# Altium project QCopterRC.PrjPCB
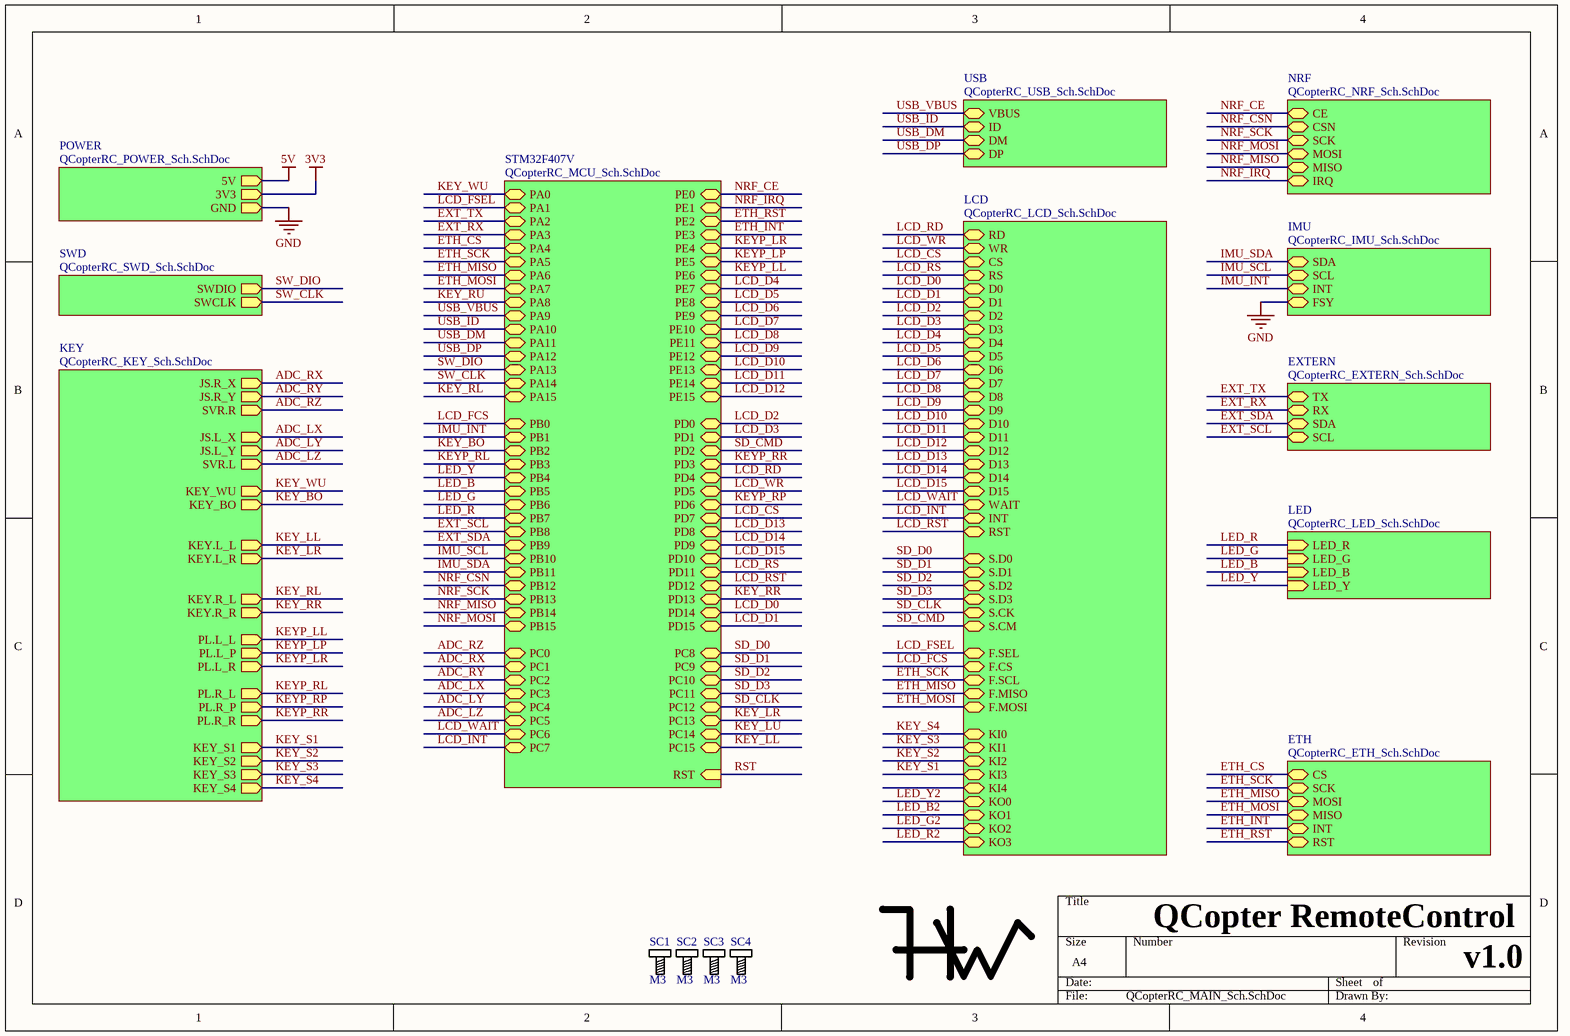
[diagram p0: QCopterRC_MAIN_Sch.SchDoc]
12 sheets, 127 parts. Net scope: hierarchical (ports join the sheet entries above them; power ports are global).
Board file: QCopterRC__Pcb.PcbDoc
Sheets:
  QCopterRC_MAIN_Sch.SchDoc
    POWER = QCopterRC_POWER_Sch.SchDoc
    SWD = QCopterRC_SWD_Sch.SchDoc
    LED = QCopterRC_LED_Sch.SchDoc
    STM32F407V = QCopterRC_MCU_Sch.SchDoc
    LCD = QCopterRC_LCD_Sch.SchDoc
    USB = QCopterRC_USB_Sch.SchDoc
    NRF = QCopterRC_NRF_Sch.SchDoc
    IMU = QCopterRC_IMU_Sch.SchDoc
    EXTERN = QCopterRC_EXTERN_Sch.SchDoc
    ETH = QCopterRC_ETH_Sch.SchDoc
    KEY = QCopterRC_KEY_Sch.SchDoc

## Sheet QCopterRC_MAIN_Sch.SchDoc
size A4

### Parts
HW1  HW  [Logo_HW]  (value not drawn)
SC1  M3  [SCRREW_M3]
SC2  M3  [SCRREW_M3]
SC3  M3  [SCRREW_M3]
SC4  M3  [SCRREW_M3]

### Sub-sheets
ETH = QCopterRC_ETH_Sch.SchDoc: MISO, MOSI, SCK, CS, INT, RST
EXTERN = QCopterRC_EXTERN_Sch.SchDoc: SDA, SCL, TX, RX
IMU = QCopterRC_IMU_Sch.SchDoc: SCL, SDA, FSY, INT
KEY = QCopterRC_KEY_Sch.SchDoc: KEY_WU (out), KEY_BO (out), JS.R_Y (out), JS.R_X (out), JS.L_X (out), JS.L_Y (out), SVR.R (out), SVR.L (out), KEY.L_L (out), KEY.L_R (out), KEY.R_L (out), KEY.R_R (out), PL.L_L (out), PL.L_P (out), PL.L_R (out), PL.R_R (out), PL.R_P (out), PL.R_L (out), KEY_S1 (out), KEY_S2 (out), KEY_S3 (out), KEY_S4 (out)
LCD = QCopterRC_LCD_Sch.SchDoc: RS, CS, WR, RD, RST, D0, D1, D2, D3, D4, D5, D6, D7, D8, D9, D10, D11, D12, D13, D14, D15, WAIT, INT, S.D0, S.CK, S.CM, S.D1, S.D2, S.D3, F.CS, F.SCL, F.MISO, F.MOSI, F.SEL, KI0, KI1, KI2, KI3, KI4, KO0, KO1, KO2, KO3
LED = QCopterRC_LED_Sch.SchDoc: LED_R (in), LED_G (in), LED_B (in), LED_Y (in)
NRF = QCopterRC_NRF_Sch.SchDoc: MISO, MOSI, SCK, CSN, CE, IRQ
POWER = QCopterRC_POWER_Sch.SchDoc: 3V3 (out), 5V (out), GND (out)
STM32F407V = QCopterRC_MCU_Sch.SchDoc: PA0, PA1, PA2, PA3, PA4, PA5, PA6, PA7, PA8, PA9, PA10, PA11, PA12, PA13, PA14, PA15, PB0, PB1, PB2, PB3, PB4, PB5, PB6, PB7, PB8, PB9, PB10, PB11, PB12, PB13, PB14, PB15, PC0, PC1, PC2, PC3, PC4, PC5, PC6, PC7, PC8, PC9, PC10, PC11, PC12, PC13, PC14, PC15, PD0, PD1, PD2, PD3, PD4, PD5, PD6, PD7, PD8, PD9, PD10, PD11, PD12, PD13, PD14, PD15, RST (in), PE0, PE1, PE2, PE3, PE4, PE5, PE6, PE7, PE8, PE9, PE10, PE11, PE12, PE13, PE14, PE15
SWD = QCopterRC_SWD_Sch.SchDoc: SWDIO (out), SWCLK (out)
USB = QCopterRC_USB_Sch.SchDoc: VBUS, ID, DM, DP

### Nets
GND: sheet POWER/GND, sheet IMU/FSY
USB_VBUS: sheet STM32F407V/PA9, sheet USB/VBUS
ADC_LX: sheet STM32F407V/PC3, sheet KEY/JS.L_X
ADC_LY: sheet STM32F407V/PC4, sheet KEY/JS.L_Y
ADC_LZ: sheet STM32F407V/PC5, sheet KEY/SVR.L
ADC_RX: sheet STM32F407V/PC1, sheet KEY/JS.R_X
ADC_RY: sheet STM32F407V/PC2, sheet KEY/JS.R_Y
ADC_RZ: sheet STM32F407V/PC0, sheet KEY/SVR.R
ETH_CS: sheet STM32F407V/PA4, sheet ETH/CS
ETH_INT: sheet STM32F407V/PE3, sheet ETH/INT
ETH_MISO: sheet STM32F407V/PA6, sheet LCD/F.MISO, sheet ETH/MOSI
ETH_MOSI: sheet STM32F407V/PA7, sheet LCD/F.MOSI, sheet ETH/MISO
ETH_RST: sheet STM32F407V/PE2, sheet ETH/RST
ETH_SCK: sheet STM32F407V/PA5, sheet LCD/F.SCL, sheet ETH/SCK
EXT_RX: sheet STM32F407V/PA3, sheet EXTERN/RX
EXT_SCL: sheet STM32F407V/PB8, sheet EXTERN/SCL
EXT_SDA: sheet STM32F407V/PB9, sheet EXTERN/SDA
EXT_TX: sheet STM32F407V/PA2, sheet EXTERN/TX
IMU_INT: sheet STM32F407V/PB1, sheet IMU/INT
IMU_SCL: sheet STM32F407V/PB10, sheet IMU/SCL
IMU_SDA: sheet STM32F407V/PB11, sheet IMU/SDA
KEY_BO: sheet STM32F407V/PB2, sheet KEY/KEY_BO
KEY_LL: sheet STM32F407V/PC15, sheet KEY/KEY.L_L
KEY_LR: sheet STM32F407V/PC13, sheet KEY/KEY.L_R
KEY_RL: sheet STM32F407V/PA15, sheet KEY/KEY.R_L
KEY_RR: sheet STM32F407V/PD13, sheet KEY/KEY.R_R
KEY_S1: sheet LCD/KI3, sheet KEY/KEY_S1
KEY_S2: sheet LCD/KI2, sheet KEY/KEY_S2
KEY_S3: sheet LCD/KI1, sheet KEY/KEY_S3
KEY_S4: sheet LCD/KI0, sheet KEY/KEY_S4
KEY_WU: sheet STM32F407V/PA0, sheet KEY/KEY_WU
KEYP_LL: sheet STM32F407V/PE6, sheet KEY/PL.L_L
KEYP_LP: sheet STM32F407V/PE5, sheet KEY/PL.L_P
KEYP_LR: sheet STM32F407V/PE4, sheet KEY/PL.L_R
KEYP_RL: sheet STM32F407V/PB3, sheet KEY/PL.R_L
KEYP_RP: sheet STM32F407V/PD6, sheet KEY/PL.R_P
KEYP_RR: sheet STM32F407V/PD3, sheet KEY/PL.R_R
LCD_CS: sheet STM32F407V/PD7, sheet LCD/CS
LCD_D0: sheet STM32F407V/PD14, sheet LCD/D0
LCD_D1: sheet STM32F407V/PD15, sheet LCD/D1
LCD_D2: sheet STM32F407V/PD0, sheet LCD/D2
LCD_D3: sheet STM32F407V/PD1, sheet LCD/D3
LCD_D4: sheet STM32F407V/PE7, sheet LCD/D4
LCD_D5: sheet STM32F407V/PE8, sheet LCD/D5
LCD_D6: sheet STM32F407V/PE9, sheet LCD/D6
LCD_D7: sheet STM32F407V/PE10, sheet LCD/D7
LCD_D8: sheet STM32F407V/PE11, sheet LCD/D8
LCD_D9: sheet STM32F407V/PE12, sheet LCD/D9
LCD_D10: sheet STM32F407V/PE13, sheet LCD/D10
LCD_D11: sheet STM32F407V/PE14, sheet LCD/D11
LCD_D12: sheet STM32F407V/PE15, sheet LCD/D12
LCD_D13: sheet STM32F407V/PD8, sheet LCD/D13
LCD_D14: sheet STM32F407V/PD9, sheet LCD/D14
LCD_D15: sheet STM32F407V/PD10, sheet LCD/D15
LCD_FCS: sheet STM32F407V/PB0, sheet LCD/F.CS
LCD_FSEL: sheet STM32F407V/PA1, sheet LCD/F.SEL
LCD_INT: sheet STM32F407V/PC7, sheet LCD/INT
LCD_RD: sheet STM32F407V/PD4, sheet LCD/RD
LCD_RS: sheet STM32F407V/PD11, sheet LCD/RS
LCD_RST: sheet STM32F407V/PD12, sheet LCD/RST
LCD_WAIT: sheet STM32F407V/PC6, sheet LCD/WAIT
LCD_WR: sheet STM32F407V/PD5, sheet LCD/WR
LED_B: sheet LED/LED_B, sheet STM32F407V/PB5
LED_B2: sheet LCD/KO1
LED_G: sheet LED/LED_G, sheet STM32F407V/PB6
LED_G2: sheet LCD/KO2
LED_R: sheet LED/LED_R, sheet STM32F407V/PB7
LED_R2: sheet LCD/KO3
LED_Y: sheet LED/LED_Y, sheet STM32F407V/PB4
LED_Y2: sheet LCD/KO0
NRF_CE: sheet STM32F407V/PE0, sheet NRF/CE
NRF_CSN: sheet STM32F407V/PB12, sheet NRF/CSN
NRF_IRQ: sheet STM32F407V/PE1, sheet NRF/IRQ
NRF_MISO: sheet STM32F407V/PB14, sheet NRF/MISO
NRF_MOSI: sheet STM32F407V/PB15, sheet NRF/MOSI
NRF_SCK: sheet STM32F407V/PB13, sheet NRF/SCK
SD_CLK: sheet STM32F407V/PC12, sheet LCD/S.CK
SD_CMD: sheet STM32F407V/PD2, sheet LCD/S.CM
SD_D0: sheet STM32F407V/PC8, sheet LCD/S.D0
SD_D1: sheet STM32F407V/PC9, sheet LCD/S.D1
SD_D2: sheet STM32F407V/PC10, sheet LCD/S.D2
SD_D3: sheet STM32F407V/PC11, sheet LCD/S.D3
SW_CLK: sheet SWD/SWCLK, sheet STM32F407V/PA14
SW_DIO: sheet SWD/SWDIO, sheet STM32F407V/PA13
USB_DM: sheet STM32F407V/PA11, sheet USB/DM
USB_DP: sheet STM32F407V/PA12, sheet USB/DP
USB_ID: sheet STM32F407V/PA10, sheet USB/ID

### Notes on the sheet
- QCopter RemoteControl
- v1.0

### Library data of the parts
HW1 = HW: Logo
SC1-SC4 = Screw_M3: Screw

## Sheet QCopterRC_POWER_Sch.SchDoc
size A4
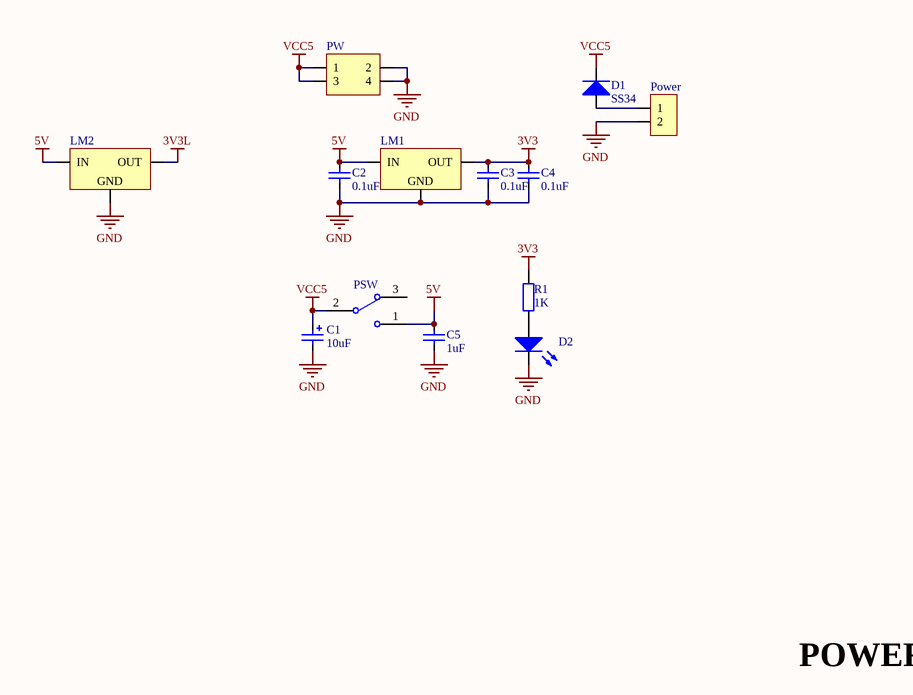
[diagram p1: QCopterRC_POWER_Sch.SchDoc]

### Parts
C1  value 10uF  [CAP_TAN_B1210]  (hidden comment: Cap_Tan_1210)
C2  value 0.1uF  [CAP_0603]  (hidden comment: Cap_0603)
C3  value 0.1uF  [CAP_0603]  (hidden comment: Cap_0603)
C4  value 0.1uF  [CAP_0603]  (hidden comment: Cap_0603)
C5  value 1uF  [CAP_0603]  (hidden comment: Cap_0603)
D1  SMA: SS34  [DO-214AC]  (hidden comment: Diode_SMA)
D2  LED_0603_WHITE  [LED_0603_WHITE]  (value not drawn)
LM1  LM1117  [SOT223]  (value not drawn)
LM2  LM1117  [SOT223]  (value not drawn)
Power  HDR1X2_90_2.54  [HDR1X2_90_2.54]  (value not drawn)
PSW  SW_SPDT_4.3X8.6_D90  [SW_SPDT_4.3X8.6_D90]  (value not drawn)
PW  HDR2X2_90_2.54  [HDR2X2_90_2.54]  (value not drawn)
R1  value 1K  [RES_0603]  (hidden comment: Res_0603)

### Nets
3V3: C3.2 C4.2 LM1.2(OUT) R1.2
3V3L: LM2.2(OUT)
5V: C2.1 C5.2 LM1.3(IN) LM2.3(IN) PSW.1
GND: C1.2 C2.2 C3.1 C4.1 C5.1 D2.2(K) LM1.1(GND) LM2.1(GND) Power.2 PW.2 PW.4
VCC5: C1.1 D1.2(K) PSW.2 PW.1 PW.3  [project net USB_VBUS]
NetD1_1: D1.1(A) Power.1
NetD2_1: D2.1(A) R1.1

Not connected (* = marked no-connect by the designer): PSW 3

### Notes on the sheet
- POWER

### Library data of the parts
C1 = Cap_Tan_1210: Capacitor
C2-C5 = Cap_0603: Capacitor
D1 = Diode_SMA: Diode
D2 = LED_0603_WHITE: LED
LM1 LM2 = LM1117: Power
Power = HDR1X2_90_2.54: Header
PSW = SW_SPDT_4.3X8.6_D90: Switch
PW = HDR2X2_90_2.54: Header
R1 = Res_0603: Resistor

## Sheet QCopterRC_SWD_Sch.SchDoc
size A4
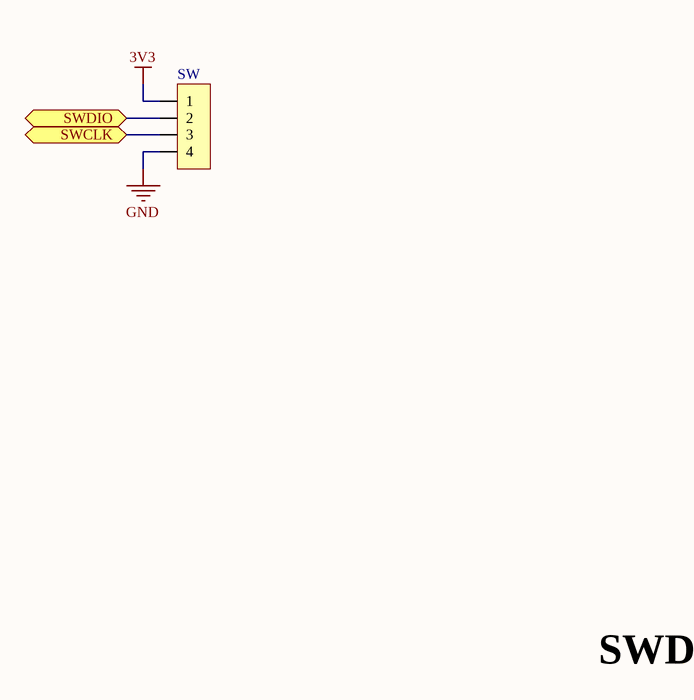
[diagram p2: QCopterRC_SWD_Sch.SchDoc]

### Parts
SW  HDR1X4_90F_2.54  [HDR1X4_90F_2.54]  (value not drawn)

### Ports
SWCLK, SWDIO

### Nets
3V3: SW.1
GND: SW.4
SW_CLK: SW.3 ; port SWCLK
SW_DIO: SW.2 ; port SWDIO

### Notes on the sheet
- SWD

### Library data of the parts
SW = HDR1X4_90F_2.54: Header

## Sheet QCopterRC_LED_Sch.SchDoc
size A4
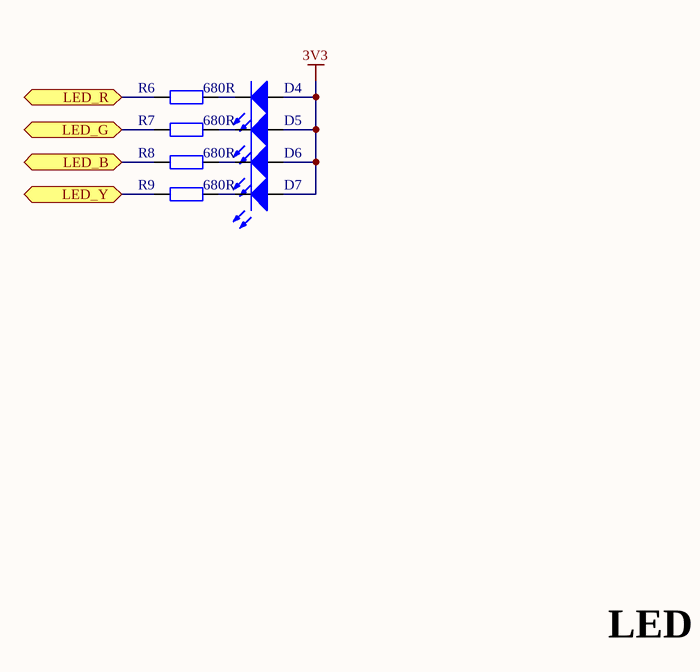
[diagram p3: QCopterRC_LED_Sch.SchDoc]

### Parts
D4  LED_0603_RED  [LED_0603_RED]  (value not drawn)
D5  LED_0603_GREEN  [LED_0603_GREEN]  (value not drawn)
D6  LED_0603_BLUE  [LED_0603_BLUE]  (value not drawn)
D7  LED_0603_YELLOW  [LED_0603_YELLOW]  (value not drawn)
R6  value 680R  [RES_0603]  (hidden comment: Res_0603)
R7  value 680R  [RES_0603]  (hidden comment: Res_0603)
R8  value 680R  [RES_0603]  (hidden comment: Res_0603)
R9  value 680R  [RES_0603]  (hidden comment: Res_0603)

### Ports
LED_B, LED_G, LED_R, LED_Y

### Nets
3V3: D4.1(A) D5.1(A) D6.1(A) D7.1(A)
LED_B: R8.1 ; port LED_B
LED_G: R7.1 ; port LED_G
LED_R: R6.1 ; port LED_R
LED_Y: R9.1 ; port LED_Y
NetD4_2: D4.2(K) R6.2
NetD5_2: D5.2(K) R7.2
NetD6_2: D6.2(K) R8.2
NetD7_2: D7.2(K) R9.2

### Notes on the sheet
- LED

### Library data of the parts
D4 = LED_0603_RED: LED
D5 = LED_0603_GREEN: LED
D6 = LED_0603_BLUE: LED
D7 = LED_0603_YELLOW: LED
R6-R9 = Res_0603: Resistor

## Sheet QCopterRC_MCU_Sch.SchDoc
size A4
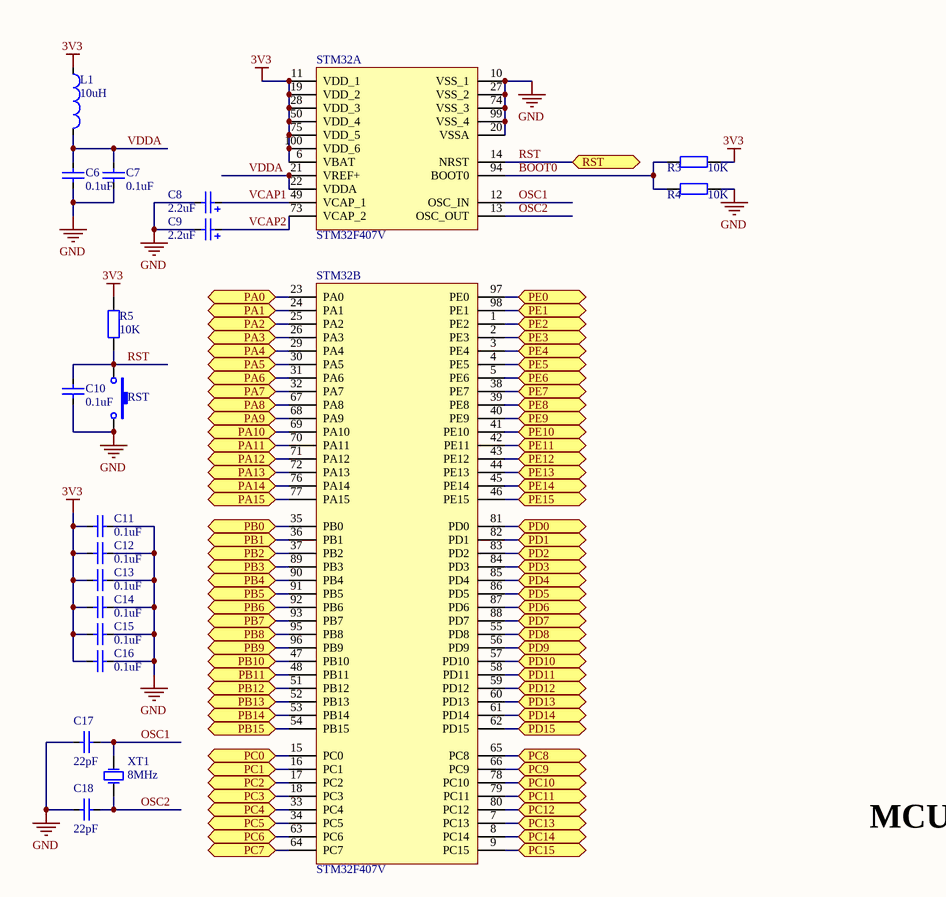
[diagram p4: QCopterRC_MCU_Sch.SchDoc]

### Parts
C6  value 0.1uF  [CAP_0603]  (hidden comment: Cap_0603)
C7  value 0.1uF  [CAP_0603]  (hidden comment: Cap_0603)
C8  value 2.2uF  [CAP_TAN_P0805]  (hidden comment: Cap_Tan_0805)
C9  value 2.2uF  [CAP_TAN_P0805]  (hidden comment: Cap_Tan_0805)
C10  value 0.1uF  [CAP_0603]  (hidden comment: Cap_0603)
C11  value 0.1uF  [CAP_0603]  (hidden comment: Cap_0603)
C12  value 0.1uF  [CAP_0603]  (hidden comment: Cap_0603)
C13  value 0.1uF  [CAP_0603]  (hidden comment: Cap_0603)
C14  value 0.1uF  [CAP_0603]  (hidden comment: Cap_0603)
C15  value 0.1uF  [CAP_0603]  (hidden comment: Cap_0603)
C16  value 0.1uF  [CAP_0603]  (hidden comment: Cap_0603)
C17  value 22pF  [CAP_0603]  (hidden comment: Cap_0603)
C18  value 22pF  [CAP_0603]  (hidden comment: Cap_0603)
L1  value 10uH  [IND_0603]  (hidden comment: Ind_0603)
R3  value 10K  [RES_0603]  (hidden comment: Res_0603)
R4  value 10K  [RES_0603]  (hidden comment: Res_0603)
R5  value 10K  [RES_0603]  (hidden comment: Res_0603)
RST  BT_TACT_3x6_180  [BT_TACT_3x6_180]  (value not drawn)
STM32  STM32F407V  [STM32F_100]  (parts A,B of 2)
XT1  value 8MHz  [XTAL_5032]  (hidden comment: XTAL_5032)

### Ports
PA0, PA1, PA2, PA3, PA4, PA5, PA6, PA7, PA8, PA9, PA10, PA11, PA12, PA13, PA14, PA15, PB0, PB1, PB2, PB3, PB4, PB5, PB6, PB7, PB8, PB9, PB10, PB11, PB12, PB13, PB14, PB15, PC0, PC1, PC2, PC3, PC4, PC5, PC6, PC7, PC8, PC9, PC10, PC11, PC12, PC13, PC14, PC15, PD0, PD1, PD2, PD3, PD4, PD5, PD6, PD7, PD8, PD9, PD10, PD11, PD12, PD13, PD14, PD15, PE0, PE1, PE2, PE3, PE4, PE5, PE6, PE7, PE8, PE9, PE10, PE11, PE12, PE13, PE14, PE15, RST

### Nets
3V3: C11.2 C12.2 C13.2 C14.2 C15.2 C16.2 L1.1 R3.2 R5.1 STM32.6(VBAT) STM32.11(VDD_1) STM32.19(VDD_2) STM32.28(VDD_3) STM32.50(VDD_4) STM32.75(VDD_5) STM32.100(VDD_6)
GND: C6.2 C7.2 C8.2 C9.2 C10.2 C11.1 C12.1 C13.1 C14.1 C15.1 C16.1 C17.1 C18.1 R4.2 RST.2 STM32.10(VSS_1) STM32.20(VSSA) STM32.27(VSS_2) STM32.74(VSS_3) STM32.99(VSS_4)
USB_VBUS: STM32.68(PA9) ; port PA9
ADC_LX: STM32.18(PC3) ; port PC3
ADC_LY: STM32.33(PC4) ; port PC4
ADC_LZ: STM32.34(PC5) ; port PC5
ADC_RX: STM32.16(PC1) ; port PC1
ADC_RY: STM32.17(PC2) ; port PC2
ADC_RZ: STM32.15(PC0) ; port PC0
BOOT0: R3.1 R4.1 STM32.94(BOOT0)
ETH_CS: STM32.29(PA4) ; port PA4
ETH_INT: STM32.2(PE3) ; port PE3
ETH_MISO: STM32.31(PA6) ; port PA6
ETH_MOSI: STM32.32(PA7) ; port PA7
ETH_RST: STM32.1(PE2) ; port PE2
ETH_SCK: STM32.30(PA5) ; port PA5
EXT_RX: STM32.26(PA3) ; port PA3
EXT_SCL: STM32.95(PB8) ; port PB8
EXT_SDA: STM32.96(PB9) ; port PB9
EXT_TX: STM32.25(PA2) ; port PA2
IMU_INT: STM32.36(PB1) ; port PB1
IMU_SCL: STM32.47(PB10) ; port PB10
IMU_SDA: STM32.48(PB11) ; port PB11
KEY_BO: STM32.37(PB2) ; port PB2
KEY_LL: STM32.9(PC15) ; port PC15
KEY_LR: STM32.7(PC13) ; port PC13
KEY_LU: STM32.8(PC14) ; port PC14
KEY_RL: STM32.77(PA15) ; port PA15
KEY_RR: STM32.60(PD13) ; port PD13
KEY_RU: STM32.67(PA8) ; port PA8
KEY_WU: STM32.23(PA0) ; port PA0
KEYP_LL: STM32.5(PE6) ; port PE6
KEYP_LP: STM32.4(PE5) ; port PE5
KEYP_LR: STM32.3(PE4) ; port PE4
KEYP_RL: STM32.89(PB3) ; port PB3
KEYP_RP: STM32.87(PD6) ; port PD6
KEYP_RR: STM32.84(PD3) ; port PD3
LCD_CS: STM32.88(PD7) ; port PD7
LCD_D0: STM32.61(PD14) ; port PD14
LCD_D1: STM32.62(PD15) ; port PD15
LCD_D2: STM32.81(PD0) ; port PD0
LCD_D3: STM32.82(PD1) ; port PD1
LCD_D4: STM32.38(PE7) ; port PE7
LCD_D5: STM32.39(PE8) ; port PE8
LCD_D6: STM32.40(PE9) ; port PE9
LCD_D7: STM32.41(PE10) ; port PE10
LCD_D8: STM32.42(PE11) ; port PE11
LCD_D9: STM32.43(PE12) ; port PE12
LCD_D10: STM32.44(PE13) ; port PE13
LCD_D11: STM32.45(PE14) ; port PE14
LCD_D12: STM32.46(PE15) ; port PE15
LCD_D13: STM32.55(PD8) ; port PD8
LCD_D14: STM32.56(PD9) ; port PD9
LCD_D15: STM32.57(PD10) ; port PD10
LCD_FCS: STM32.35(PB0) ; port PB0
LCD_FSEL: STM32.24(PA1) ; port PA1
LCD_INT: STM32.64(PC7) ; port PC7
LCD_RD: STM32.85(PD4) ; port PD4
LCD_RS: STM32.58(PD11) ; port PD11
LCD_RST: STM32.59(PD12) ; port PD12
LCD_WAIT: STM32.63(PC6) ; port PC6
LCD_WR: STM32.86(PD5) ; port PD5
LED_B: STM32.91(PB5) ; port PB5
LED_G: STM32.92(PB6) ; port PB6
LED_R: STM32.93(PB7) ; port PB7
LED_Y: STM32.90(PB4) ; port PB4
NRF_CE: STM32.97(PE0) ; port PE0
NRF_CSN: STM32.51(PB12) ; port PB12
NRF_IRQ: STM32.98(PE1) ; port PE1
NRF_MISO: STM32.53(PB14) ; port PB14
NRF_MOSI: STM32.54(PB15) ; port PB15
NRF_SCK: STM32.52(PB13) ; port PB13
OSC1: C17.2 STM32.12(OSC_IN) XT1.2(OSC2)
OSC2: C18.2 STM32.13(OSC_OUT) XT1.1(OSC1)
RST: C10.1 R5.2 RST.1 STM32.14(NRST) ; port RST
SD_CLK: STM32.80(PC12) ; port PC12
SD_CMD: STM32.83(PD2) ; port PD2
SD_D0: STM32.65(PC8) ; port PC8
SD_D1: STM32.66(PC9) ; port PC9
SD_D2: STM32.78(PC10) ; port PC10
SD_D3: STM32.79(PC11) ; port PC11
SW_CLK: STM32.76(PA14) ; port PA14
SW_DIO: STM32.72(PA13) ; port PA13
USB_DM: STM32.70(PA11) ; port PA11
USB_DP: STM32.71(PA12) ; port PA12
USB_ID: STM32.69(PA10) ; port PA10
VCAP1: C8.1 STM32.49(VCAP_1)
VCAP2: C9.1 STM32.73(VCAP_2)
VDDA: C6.1 C7.1 L1.2 STM32.21(VREF+) STM32.22(VDDA)

### Notes on the sheet
- MCU

### Library data of the parts
C6 C7 C10-C18 = Cap_0603: Capacitor
C8 C9 = Cap_Tan_0805: Capacitor
L1 = Ind_0603: Inductor
R3-R5 = Res_0603: Resistor
RST = BT_TACT_3x6_180: Switch
STM32 = STM32F407V: MCU
XT1 = XTAL_5032: Crystal Oscillator; Published: 8-Jun-2000; LatestRevisionDate: 17-Jul-2002; LatestRevisionNote: Re-released for DXP Platform.; PackageReference: R38; Publisher: Altium Limited; PackageDescription: Crystal, Thru-Hole; 2 Leads; Body 3.1 x 8.2 mm (Dia.xH)

## Sheet QCopterRC_LCD_Sch.SchDoc
size A4; DocumentNumber: 10; SheetNumber: 10; SheetTotal: 10
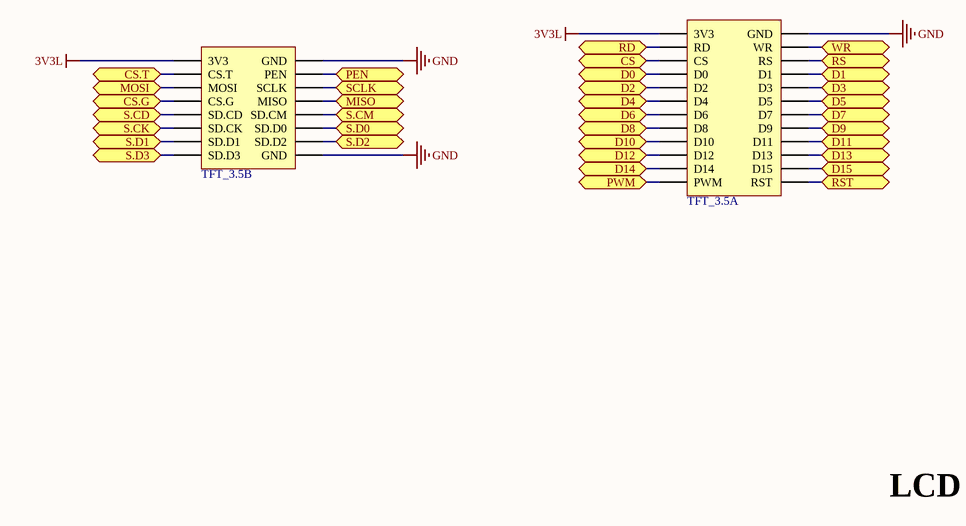
[diagram p5: QCopterRC_LCD_Sch.SchDoc]

### Parts
TFT_3.5  TFT_3.5_480*320  [TFT_3.5_480*320]  (value not drawn)  (parts A,B of 2)

### Ports
CS, CS.G, CS.T, D0, D1, D2, D3, D4, D5, D6, D7, D8, D9, D10, D11, D12, D13, D14, D15, MISO, MOSI, PEN, PWM, RD, RS, RST, S.CD, S.CK, S.CM, S.D0, S.D1, S.D2, S.D3, SCLK, WR

### Nets
3V3L: TFT_3.5.1(3V3) TFT_3.5.25(3V3)
GND: TFT_3.5.2(GND) TFT_3.5.26(GND) TFT_3.5.40(GND)
LCD_CS: TFT_3.5.5(CS) ; port CS
LCD_D0: TFT_3.5.7(D0) ; port D0
LCD_D1: TFT_3.5.8(D1) ; port D1
LCD_D2: TFT_3.5.9(D2) ; port D2
LCD_D3: TFT_3.5.10(D3) ; port D3
LCD_D4: TFT_3.5.11(D4) ; port D4
LCD_D5: TFT_3.5.12(D5) ; port D5
LCD_D6: TFT_3.5.13(D6) ; port D6
LCD_D7: TFT_3.5.14(D7) ; port D7
LCD_D8: TFT_3.5.15(D8) ; port D8
LCD_D9: TFT_3.5.16(D9) ; port D9
LCD_D10: TFT_3.5.17(D10) ; port D10
LCD_D11: TFT_3.5.18(D11) ; port D11
LCD_D12: TFT_3.5.19(D12) ; port D12
LCD_D13: TFT_3.5.20(D13) ; port D13
LCD_D14: TFT_3.5.21(D14) ; port D14
LCD_D15: TFT_3.5.22(D15) ; port D15
LCD_RD: TFT_3.5.3(RD) ; port RD
LCD_RS: TFT_3.5.6(RS) ; port RS
LCD_RST: TFT_3.5.24(RST) ; port RST
LCD_WR: TFT_3.5.4(WR) ; port WR
SD_CLK: TFT_3.5.35(SD.CK) ; port S.CK
SD_CMD: TFT_3.5.34(SD.CM) ; port S.CM
SD_D0: TFT_3.5.36(SD.D0) ; port S.D0
SD_D1: TFT_3.5.37(SD.D1) ; port S.D1
SD_D2: TFT_3.5.38(SD.D2) ; port S.D2
SD_D3: TFT_3.5.39(SD.D3) ; port S.D3
NetTFT_3.5_23: TFT_3.5.23(PWM) ; port PWM
NetTFT_3.5_27: TFT_3.5.27(CS.T) ; port CS.T
NetTFT_3.5_28: TFT_3.5.28(PEN) ; port PEN
NetTFT_3.5_29: TFT_3.5.29(MOSI) ; port MOSI
NetTFT_3.5_30: TFT_3.5.30(SCLK) ; port SCLK
NetTFT_3.5_31: TFT_3.5.31(CS.G) ; port CS.G
NetTFT_3.5_32: TFT_3.5.32(MISO) ; port MISO
NetTFT_3.5_33: TFT_3.5.33(SD.CD) ; port S.CD

### Notes on the sheet
- LCD

### Library data of the parts
TFT_3.5 = TFT_3.5_480*320: Module

## Sheet QCopterRC_USB_Sch.SchDoc
size A4
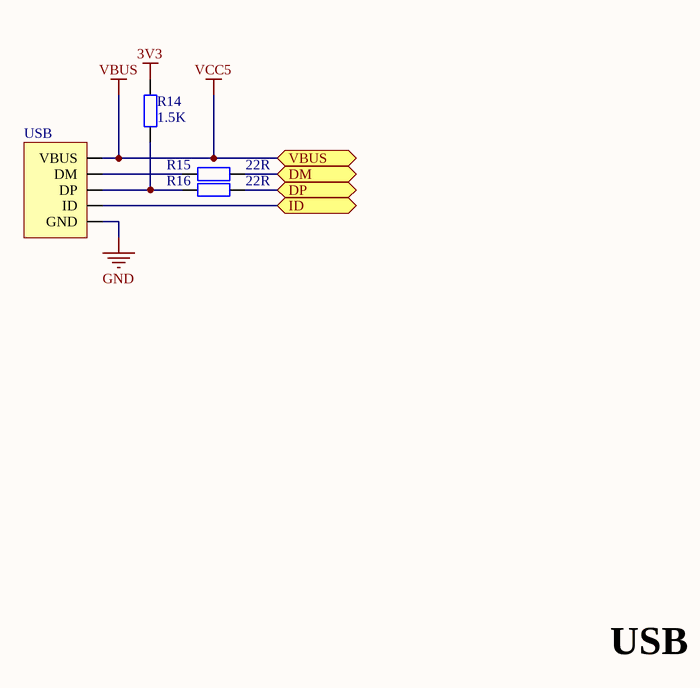
[diagram p6: QCopterRC_USB_Sch.SchDoc]

### Parts
R14  value 1.5K  [RES_0603]  (hidden comment: Res_0603)
R15  value 22R  [RES_0603]  (hidden comment: Res_0603)
R16  value 22R  [RES_0603]  (hidden comment: Res_0603)
USB  USB_Micro  [USB_MICRO_B]  (value not drawn)

### Ports
DM, DP, ID, VBUS

### Nets
3V3: R14.2
GND: USB.5(GND)
VBUS: USB.1(VBUS) ; port VBUS  [also labelled VCC5]  [project net USB_VBUS]
USB_DM: R15.2 ; port DM
USB_DP: R16.2 ; port DP
USB_ID: USB.4(ID) ; port ID
NetR14_1: R14.1 R16.1 USB.3(DP)
NetR15_1: R15.1 USB.2(DM)

### Notes on the sheet
- USB

### Library data of the parts
R14-R16 = Res_0603: Resistor
USB = USB_Micro: USB

## Sheet QCopterRC_NRF_Sch.SchDoc
size A4
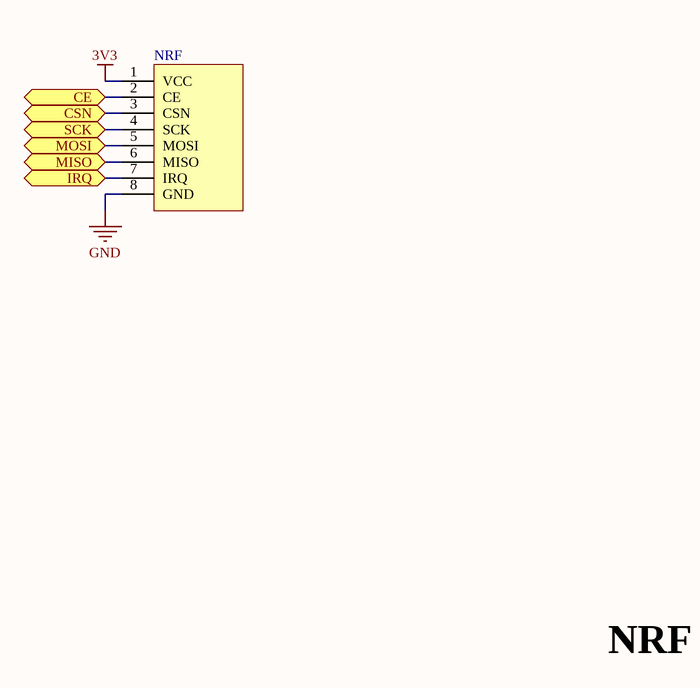
[diagram p7: QCopterRC_NRF_Sch.SchDoc]

### Parts
NRF  nRF24L01P_PA_LNA  [NRF24L01P_PA_LNA]  (value not drawn)

### Ports
CE, CSN, IRQ, MISO, MOSI, SCK

### Nets
3V3: NRF.1(VCC)
GND: NRF.8(GND)
NRF_CE: NRF.2(CE) ; port CE
NRF_CSN: NRF.3(CSN) ; port CSN
NRF_IRQ: NRF.7(IRQ) ; port IRQ
NRF_MISO: NRF.6(MISO) ; port MISO
NRF_MOSI: NRF.5(MOSI) ; port MOSI
NRF_SCK: NRF.4(SCK) ; port SCK

### Notes on the sheet
- NRF

### Library data of the parts
NRF = nRF24L01P_PA_LNA: Module

## Sheet QCopterRC_IMU_Sch.SchDoc
size A4
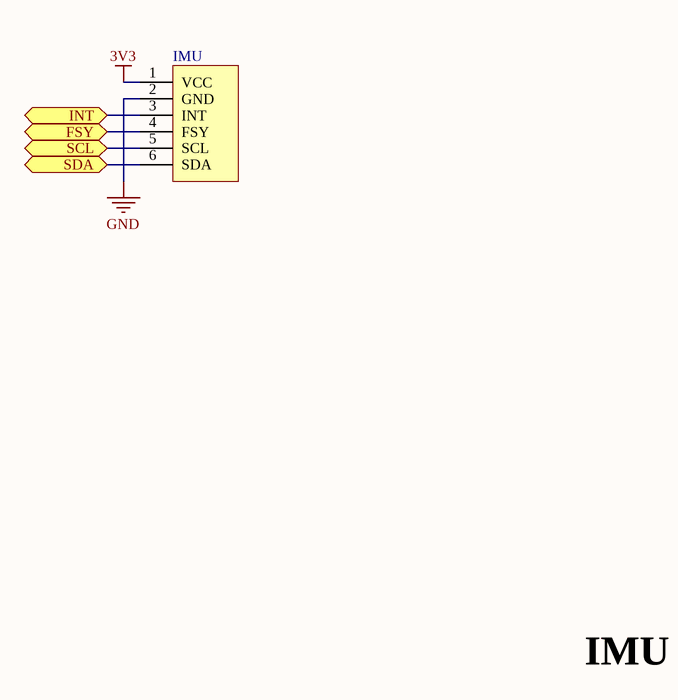
[diagram p8: QCopterRC_IMU_Sch.SchDoc]

### Parts
IMU  IMU_10-DOF  [IMU 10-DOF v1.1]  (value not drawn)

### Ports
FSY, INT, SCL, SDA

### Nets
3V3: IMU.1(VCC)
GND: IMU.2(GND) IMU.4(FSY) ; port FSY
IMU_INT: IMU.3(INT) ; port INT
IMU_SCL: IMU.5(SCL) ; port SCL
IMU_SDA: IMU.6(SDA) ; port SDA

### Notes on the sheet
- IMU

### Library data of the parts
IMU = IMU 10 DOF: Module

## Sheet QCopterRC_EXTERN_Sch.SchDoc
size A4
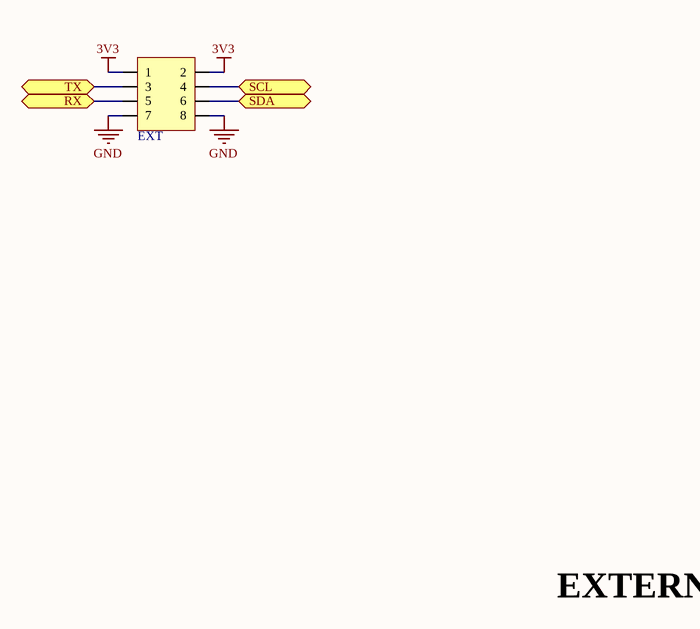
[diagram p9: QCopterRC_EXTERN_Sch.SchDoc]

### Parts
EXT  HDR2X4_90_2.54  [HDR2X4_90_2.54]  (value not drawn)

### Ports
RX, SCL, SDA, TX

### Nets
3V3: EXT.1 EXT.2
GND: EXT.7 EXT.8
EXT_RX: EXT.5 ; port RX
EXT_SCL: EXT.4 ; port SCL
EXT_SDA: EXT.6 ; port SDA
EXT_TX: EXT.3 ; port TX

### Notes on the sheet
- Labels drawn without touching a wire or pin: EXTERN

### Library data of the parts
EXT = HDR2X4_90_2.54: Header

## Sheet QCopterRC_ETH_Sch.SchDoc
size A4
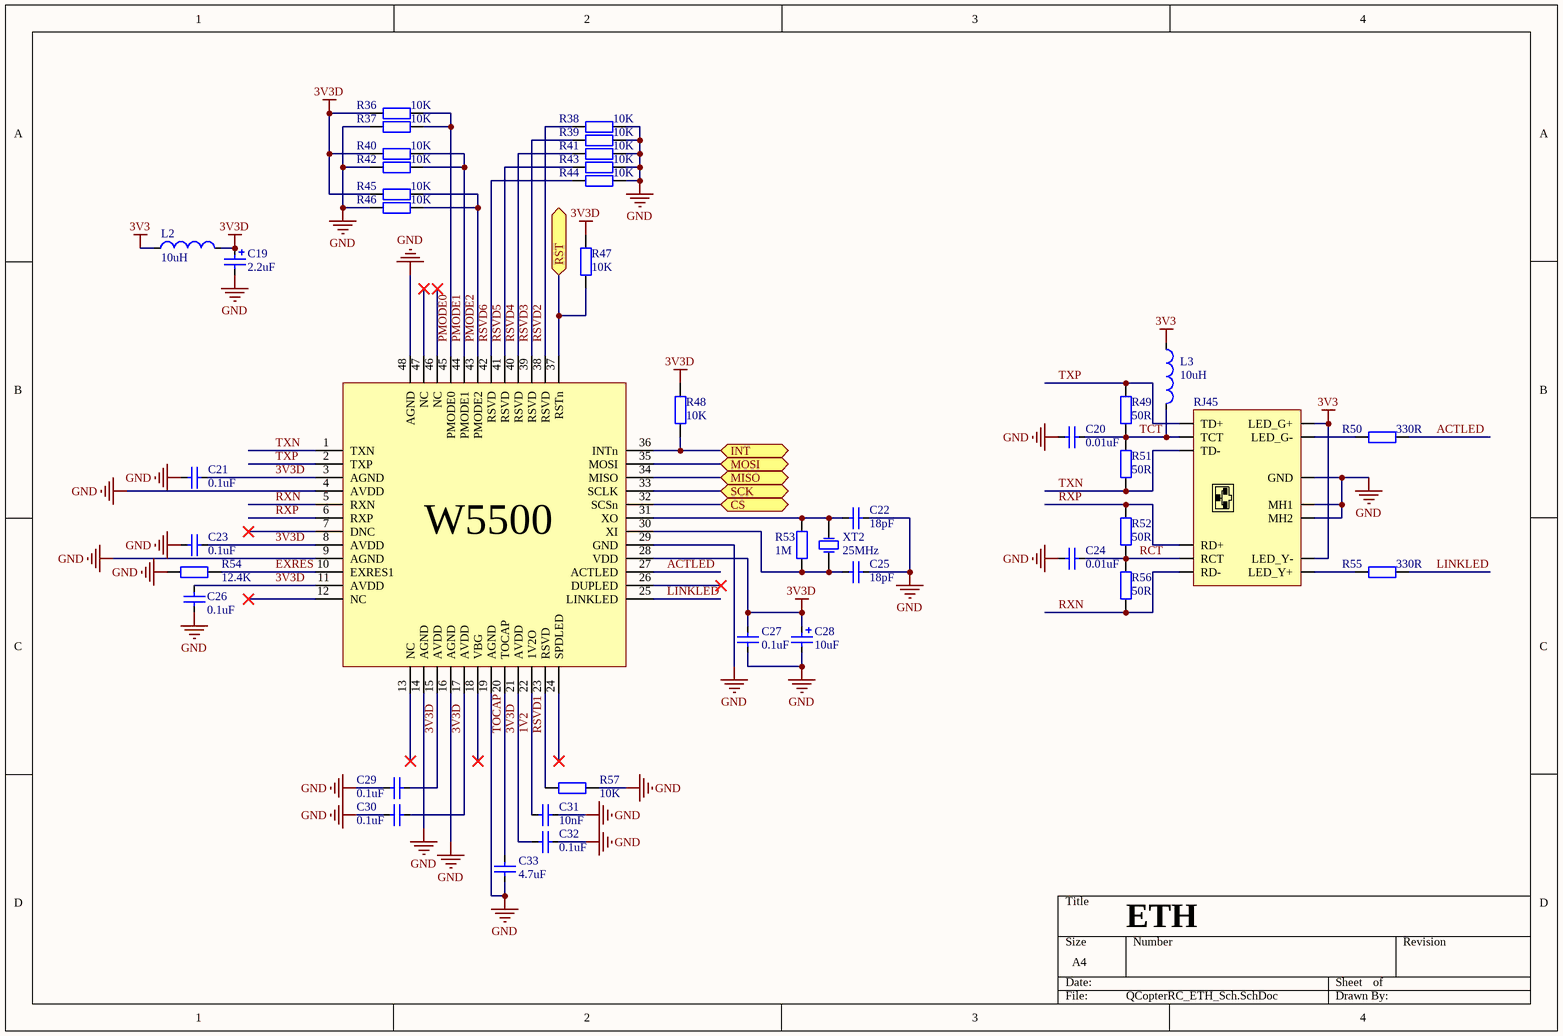
[diagram p10: QCopterRC_ETH_Sch.SchDoc]

### Parts
C19  value 2.2uF  [CAP_TAN_P0805]  (hidden comment: Cap_Tan_0805)
C20  value 0.01uF  [CAP_0603]  (hidden comment: Cap_0603)
C21  value 0.1uF  [CAP_0603]  (hidden comment: Cap_0603)
C22  value 18pF  [CAP_0603]  (hidden comment: Cap_0603)
C23  value 0.1uF  [CAP_0603]  (hidden comment: Cap_0603)
C24  value 0.01uF  [CAP_0603]  (hidden comment: Cap_0603)
C25  value 18pF  [CAP_0603]  (hidden comment: Cap_0603)
C26  value 0.1uF  [CAP_0603]  (hidden comment: Cap_0603)
C27  value 0.1uF  [CAP_0603]  (hidden comment: Cap_0603)
C28  value 10uF  [CAP_TAN_B1210]  (hidden comment: Cap_Tan_1210)
C29  value 0.1uF  [CAP_0603]  (hidden comment: Cap_0603)
C30  value 0.1uF  [CAP_0603]  (hidden comment: Cap_0603)
C31  value 10nF  [CAP_0603]  (hidden comment: Cap_0603)
C32  value 0.1uF  [CAP_0603]  (hidden comment: Cap_0603)
C33  value 4.7uF  [CAP_0603]  (hidden comment: Cap_0603)
L2  value 10uH  [IND_0603]  (hidden comment: Ind_0603)
L3  value 10uH  [IND_0603]  (hidden comment: Ind_0603)
R36  value 10K  [RES_0603]  (hidden comment: Res_0603)
R37  value 10K  [RES_0603]  (hidden comment: Res_0603)
R38  value 10K  [RES_0603]  (hidden comment: Res_0603)
R39  value 10K  [RES_0603]  (hidden comment: Res_0603)
R40  value 10K  [RES_0603]  (hidden comment: Res_0603)
R41  value 10K  [RES_0603]  (hidden comment: Res_0603)
R42  value 10K  [RES_0603]  (hidden comment: Res_0603)
R43  value 10K  [RES_0603]  (hidden comment: Res_0603)
R44  value 10K  [RES_0603]  (hidden comment: Res_0603)
R45  value 10K  [RES_0603]  (hidden comment: Res_0603)
R46  value 10K  [RES_0603]  (hidden comment: Res_0603)
R47  value 10K  [RES_0603]  (hidden comment: Res_0603)
R48  value 10K  [RES_0603]  (hidden comment: Res_0603)
R49  value 50R  [RES_0603]  (hidden comment: Res_0603)
R50  value 330R  [RES_0603]  (hidden comment: Res_0603)
R51  value 50R  [RES_0603]  (hidden comment: Res_0603)
R52  value 50R  [RES_0603]  (hidden comment: Res_0603)
R53  value 1M  [RES_0603]  (hidden comment: Res_0603)
R54  value 12.4K  [RES_0603]  (hidden comment: Res_0603)
R55  value 330R  [RES_0603]  (hidden comment: Res_0603)
R56  value 50R  [RES_0603]  (hidden comment: Res_0603)
R57  value 10K  [RES_0603]  (hidden comment: Res_0603)
RJ45  RJ45  [RJ-45_LED]  (value not drawn)
W5500  W5500  [W5500]  (value not drawn)
XT2  value 25MHz  [XTAL_5032]  (hidden comment: XTAL_5032)

### Ports
CS, INT, MISO, MOSI, RST, SCK

### Nets
3V3: L2.1 L3.1 RJ45.9(LED_G+) RJ45.11(LED_Y-)
3V3D: C19.1 C21.2 C23.2 C26.2 C27.2 C28.1 C29.1 C30.1 C32.2 L2.2 R36.2 R40.2 R45.2 R47.2 R48.2 W5500.3(AGND) W5500.8(AVDD) W5500.11(AVDD) W5500.15(AVDD) W5500.17(AVDD) W5500.21(AVDD) W5500.28(VDD)
GND: C19.2 C20.1 C21.1 C22.1 C23.1 C24.1 C25.1 C26.1 C27.1 C28.2 C29.2 C30.2 C31.1 C32.1 C33.1 R37.2 R38.1 R39.1 R41.1 R42.2 R43.1 R44.1 R46.2 R54.2 R57.2 RJ45.8(GND) RJ45.13(MH1) RJ45.14(MH2) W5500.4(AVDD) W5500.9(AGND) W5500.14(AGND) W5500.16(AGND) W5500.19(AGND) W5500.29(GND) W5500.48(AGND)
1V2: C31.2 W5500.22(1V2O)
ACTLED: R50.1 W5500.27(ACTLED)
ETH_CS: W5500.32(SCSn) ; port CS
ETH_INT: R48.1 W5500.36(INTn) ; port INT
ETH_MISO: W5500.35(MOSI) ; port MOSI
ETH_MOSI: W5500.34(MISO) ; port MISO
ETH_RST: R47.1 W5500.37(RSTn) ; port RST
ETH_SCK: W5500.33(SCLK) ; port SCK
EXRES: R54.1 W5500.10(EXRES1)
LINKLED: R55.1 W5500.25(LINKLED)
PMODE0: R36.1 R37.1 W5500.45(PMODE0)
PMODE1: R40.1 R42.1 W5500.44(PMODE1)
PMODE2: R45.1 R46.1 W5500.43(PMODE2)
RCT: C24.2 R52.1 R56.2 RJ45.5(RCT)
RSVD1: R57.1 W5500.23(RSVD)
RSVD2: R38.2 W5500.38(RSVD)
RSVD3: R39.2 W5500.39(RSVD)
RSVD4: R41.2 W5500.40(RSVD)
RSVD5: R43.2 W5500.41(RSVD)
RSVD6: R44.2 W5500.42(RSVD)
RXN: R56.1 RJ45.6(RD-) W5500.5(RXN)
RXP: R52.2 RJ45.3(RD+) W5500.6(RXP)
TCT: C20.2 L3.2 R49.1 R51.2 RJ45.4(TCT)
TOCAP: C33.2 W5500.20(TOCAP)
TXN: R51.1 RJ45.2(TD-) W5500.1(TXN)
TXP: R49.2 RJ45.1(TD+) W5500.2(TXP)
NetC22_2: C22.2 R53.2 W5500.31(XO) XT2.2(OSC2)
NetC25_2: C25.2 R53.1 W5500.30(XI) XT2.1(OSC1)
NetR50_2: R50.2 RJ45.10(LED_G-)
NetR55_2: R55.2 RJ45.12(LED_Y+)

Not connected (* = marked no-connect by the designer): W5500 7(DNC)* 12(NC)* 13(NC)* 18(VBG)* 24(SPDLED)* 26(DUPLED)* 46(NC)* 47(NC)*

### Notes on the sheet
- Labels drawn without touching a wire or pin: ETH

### Library data of the parts
C19 = Cap_Tan_0805: Capacitor
C20-C27 C29-C33 = Cap_0603: Capacitor
C28 = Cap_Tan_1210: Capacitor
L2 L3 = Ind_0603: Inductor
R36-R57 = Res_0603: Resistor
RJ45 = RJ45: ETH
W5500 = W5500: Ethernet
XT2 = XTAL_5032: Crystal Oscillator; Published: 8-Jun-2000; LatestRevisionDate: 17-Jul-2002; LatestRevisionNote: Re-released for DXP Platform.; PackageReference: R38; Publisher: Altium Limited; PackageDescription: Crystal, Thru-Hole; 2 Leads; Body 3.1 x 8.2 mm (Dia.xH)

## Sheet QCopterRC_KEY_Sch.SchDoc
size A4
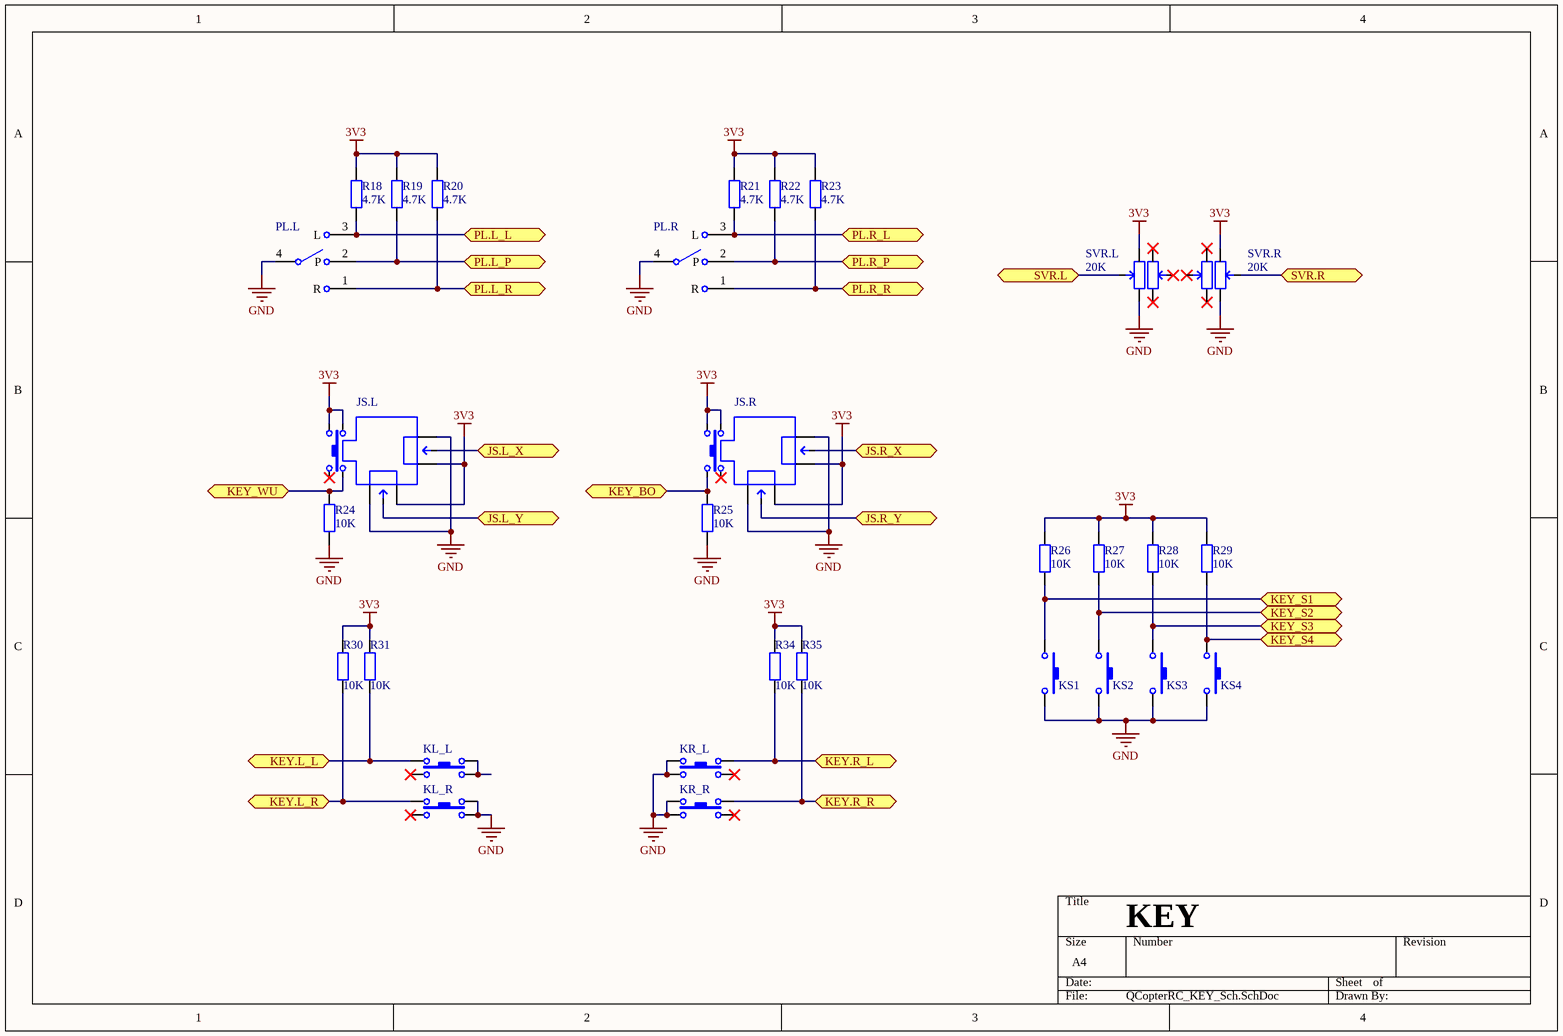
[diagram p11: QCopterRC_KEY_Sch.SchDoc]

### Parts
JS.L  JoyStick  [JoyStick]  (value not drawn)
JS.R  JoyStick  [JoyStick]  (value not drawn)
KL_L  BT_TACT_12X12_D180  [BT_TACT_12X12_D180]  (value not drawn)
KL_R  BT_TACT_12X12_D180  [BT_TACT_12X12_D180]  (value not drawn)
KR_L  BT_TACT_12X12_D180  [BT_TACT_12X12_D180]  (value not drawn)
KR_R  BT_TACT_12X12_D180  [BT_TACT_12X12_D180]  (value not drawn)
KS1  BT_TACT_3x6_180  [BT_TACT_3x6_180]  (value not drawn)
KS2  BT_TACT_3x6_180  [BT_TACT_3x6_180]  (value not drawn)
KS3  BT_TACT_3x6_180  [BT_TACT_3x6_180]  (value not drawn)
KS4  BT_TACT_3x6_180  [BT_TACT_3x6_180]  (value not drawn)
PL.L  BT_PushLever_11*12_90  [BT_PushLever_11*12_90]  (value not drawn)
PL.R  BT_PushLever_11*12_90  [BT_PushLever_11*12_90]  (value not drawn)
R18  value 4.7K  [RES_0603]  (hidden comment: Res_0603)
R19  value 4.7K  [RES_0603]  (hidden comment: Res_0603)
R20  value 4.7K  [RES_0603]  (hidden comment: Res_0603)
R21  value 4.7K  [RES_0603]  (hidden comment: Res_0603)
R22  value 4.7K  [RES_0603]  (hidden comment: Res_0603)
R23  value 4.7K  [RES_0603]  (hidden comment: Res_0603)
R24  value 10K  [RES_0603]  (hidden comment: Res_0603)
R25  value 10K  [RES_0603]  (hidden comment: Res_0603)
R26  value 10K  [RES_0603]  (hidden comment: Res_0603)
R27  value 10K  [RES_0603]  (hidden comment: Res_0603)
R28  value 10K  [RES_0603]  (hidden comment: Res_0603)
R29  value 10K  [RES_0603]  (hidden comment: Res_0603)
R30  value 10K  [RES_0603]  (hidden comment: Res_0603)
R31  value 10K  [RES_0603]  (hidden comment: Res_0603)
R34  value 10K  [RES_0603]  (hidden comment: Res_0603)
R35  value 10K  [RES_0603]  (hidden comment: Res_0603)
SVR.L  value 20K  [RES_45MM_DIP]  (hidden comment: RES_45MM_DIP)
SVR.R  value 20K  [RES_45MM_DIP]  (hidden comment: RES_45MM_DIP)

### Ports
JS.L_X, JS.L_Y, JS.R_X, JS.R_Y, KEY.L_L, KEY.L_R, KEY.R_L, KEY.R_R, KEY_BO, KEY_S1, KEY_S2, KEY_S3, KEY_S4, KEY_WU, PL.L_L, PL.L_P, PL.L_R, PL.R_L, PL.R_P, PL.R_R, SVR.L, SVR.R

### Nets
3V3: JS.L.3 JS.L.4 JS.L.7 JS.L.9 JS.R.3 JS.R.4 JS.R.7 JS.R.9 R18.1 R19.1 R20.1 R21.1 R22.1 R23.1 R26.1 R27.1 R28.1 R29.1 R30.1 R31.1 R34.1 R35.1 SVR.L.1(U) SVR.R.3(U)
GND: JS.L.1 JS.L.6 JS.R.1 JS.R.6 KL_R.2 KL_R.4 KR_L.1 KR_L.3 KR_R.1 KR_R.3 KS1.2 KS2.2 KS3.2 KS4.2 PL.L.4 PL.R.4 R24.2 R25.2 SVR.L.5(D) SVR.R.6(D)
ADC_LX: JS.L.5 ; port JS.L_X
ADC_LY: JS.L.2 ; port JS.L_Y
ADC_LZ: SVR.L.2(W) ; port SVR.L
ADC_RX: JS.R.5 ; port JS.R_X
ADC_RY: JS.R.2 ; port JS.R_Y
ADC_RZ: SVR.R.4(W) ; port SVR.R
KEY_BO: JS.R.8 R25.1 ; port KEY_BO
KEY_LL: KL_L.1 R31.2 ; port KEY.L_L
KEY_LR: KL_R.1 R30.2 ; port KEY.L_R
KEY_RL: KR_L.2 R34.2 ; port KEY.R_L
KEY_RR: KR_R.2 R35.2 ; port KEY.R_R
KEY_S1: KS1.1 R26.2 ; port KEY_S1
KEY_S2: KS2.1 R27.2 ; port KEY_S2
KEY_S3: KS3.1 R28.2 ; port KEY_S3
KEY_S4: KS4.1 R29.2 ; port KEY_S4
KEY_WU: JS.L.10 R24.1 ; port KEY_WU
KEYP_LL: PL.L.3(L) R18.2 ; port PL.L_L
KEYP_LP: PL.L.2(P) R19.2 ; port PL.L_P
KEYP_LR: PL.L.1(R) R20.2 ; port PL.L_R
KEYP_RL: PL.R.3(L) R21.2 ; port PL.R_L
KEYP_RP: PL.R.2(P) R22.2 ; port PL.R_P
KEYP_RR: PL.R.1(R) R23.2 ; port PL.R_R
NetKL_L_2: KL_L.2 KL_L.4

Not connected (* = marked no-connect by the designer): JS.L 8*; JS.R 10*; KL_L 3*; KL_R 3*; KR_L 4*; KR_R 4*; SVR.L 3(U)* 4(W)* 6(D)*; SVR.R 1(U)* 2(W)* 5(D)*

### Notes on the sheet
- KEY

### Library data of the parts
KL_L KL_R KR_L KR_R = BT_TACT_12X12_D180: Switch
KS1-KS4 = BT_TACT_3x6_180: Switch
PL.L PL.R = BT_PushLever_11*12_90: Switch
R18-R31 R34 R35 = Res_0603: Resistor
SVR.L SVR.R = RES_45MM_DIP: Resistor

## Nets that join several sheets
3V3: QCopterRC_POWER_Sch (C3.2 C4.2 LM1.2 R1.2), QCopterRC_SWD_Sch (SW.1), QCopterRC_LED_Sch (D4.1 D5.1 D6.1 D7.1), QCopterRC_MCU_Sch (16 pins), QCopterRC_USB_Sch (R14.2), QCopterRC_NRF_Sch (NRF.1), QCopterRC_IMU_Sch (IMU.1), QCopterRC_EXTERN_Sch (EXT.1 EXT.2), QCopterRC_ETH_Sch (L2.1 L3.1 RJ45.9 RJ45.11), QCopterRC_KEY_Sch (24 pins)
3V3L: QCopterRC_POWER_Sch (LM2.2), QCopterRC_LCD_Sch (TFT_3.5.1 TFT_3.5.25)
GND: QCopterRC_POWER_Sch (11 pins), QCopterRC_SWD_Sch (SW.4), QCopterRC_MCU_Sch (20 pins), QCopterRC_LCD_Sch (TFT_3.5.2 TFT_3.5.26 TFT_3.5.40), QCopterRC_USB_Sch (USB.5), QCopterRC_NRF_Sch (NRF.8), QCopterRC_IMU_Sch (IMU.2 IMU.4), QCopterRC_EXTERN_Sch (EXT.7 EXT.8), QCopterRC_ETH_Sch (35 pins), QCopterRC_KEY_Sch (20 pins)
USB_VBUS: QCopterRC_POWER_Sch (5 pins), QCopterRC_MCU_Sch (STM32.68), QCopterRC_USB_Sch (USB.1)
ADC_LX: QCopterRC_MCU_Sch (STM32.18), QCopterRC_KEY_Sch (JS.L.5)
ADC_LY: QCopterRC_MCU_Sch (STM32.33), QCopterRC_KEY_Sch (JS.L.2)
ADC_LZ: QCopterRC_MCU_Sch (STM32.34), QCopterRC_KEY_Sch (SVR.L.2)
ADC_RX: QCopterRC_MCU_Sch (STM32.16), QCopterRC_KEY_Sch (JS.R.5)
ADC_RY: QCopterRC_MCU_Sch (STM32.17), QCopterRC_KEY_Sch (JS.R.2)
ADC_RZ: QCopterRC_MCU_Sch (STM32.15), QCopterRC_KEY_Sch (SVR.R.4)
ETH_CS: QCopterRC_MCU_Sch (STM32.29), QCopterRC_ETH_Sch (W5500.32)
ETH_INT: QCopterRC_MCU_Sch (STM32.2), QCopterRC_ETH_Sch (R48.1 W5500.36)
ETH_MISO: QCopterRC_MCU_Sch (STM32.31), QCopterRC_ETH_Sch (W5500.35)
ETH_MOSI: QCopterRC_MCU_Sch (STM32.32), QCopterRC_ETH_Sch (W5500.34)
ETH_RST: QCopterRC_MCU_Sch (STM32.1), QCopterRC_ETH_Sch (R47.1 W5500.37)
ETH_SCK: QCopterRC_MCU_Sch (STM32.30), QCopterRC_ETH_Sch (W5500.33)
EXT_RX: QCopterRC_MCU_Sch (STM32.26), QCopterRC_EXTERN_Sch (EXT.5)
EXT_SCL: QCopterRC_MCU_Sch (STM32.95), QCopterRC_EXTERN_Sch (EXT.4)
EXT_SDA: QCopterRC_MCU_Sch (STM32.96), QCopterRC_EXTERN_Sch (EXT.6)
EXT_TX: QCopterRC_MCU_Sch (STM32.25), QCopterRC_EXTERN_Sch (EXT.3)
IMU_INT: QCopterRC_MCU_Sch (STM32.36), QCopterRC_IMU_Sch (IMU.3)
IMU_SCL: QCopterRC_MCU_Sch (STM32.47), QCopterRC_IMU_Sch (IMU.5)
IMU_SDA: QCopterRC_MCU_Sch (STM32.48), QCopterRC_IMU_Sch (IMU.6)
KEY_BO: QCopterRC_MCU_Sch (STM32.37), QCopterRC_KEY_Sch (JS.R.8 R25.1)
KEY_LL: QCopterRC_MCU_Sch (STM32.9), QCopterRC_KEY_Sch (KL_L.1 R31.2)
KEY_LR: QCopterRC_MCU_Sch (STM32.7), QCopterRC_KEY_Sch (KL_R.1 R30.2)
KEY_RL: QCopterRC_MCU_Sch (STM32.77), QCopterRC_KEY_Sch (KR_L.2 R34.2)
KEY_RR: QCopterRC_MCU_Sch (STM32.60), QCopterRC_KEY_Sch (KR_R.2 R35.2)
KEY_WU: QCopterRC_MCU_Sch (STM32.23), QCopterRC_KEY_Sch (JS.L.10 R24.1)
KEYP_LL: QCopterRC_MCU_Sch (STM32.5), QCopterRC_KEY_Sch (PL.L.3 R18.2)
KEYP_LP: QCopterRC_MCU_Sch (STM32.4), QCopterRC_KEY_Sch (PL.L.2 R19.2)
KEYP_LR: QCopterRC_MCU_Sch (STM32.3), QCopterRC_KEY_Sch (PL.L.1 R20.2)
KEYP_RL: QCopterRC_MCU_Sch (STM32.89), QCopterRC_KEY_Sch (PL.R.3 R21.2)
KEYP_RP: QCopterRC_MCU_Sch (STM32.87), QCopterRC_KEY_Sch (PL.R.2 R22.2)
KEYP_RR: QCopterRC_MCU_Sch (STM32.84), QCopterRC_KEY_Sch (PL.R.1 R23.2)
LCD_CS: QCopterRC_MCU_Sch (STM32.88), QCopterRC_LCD_Sch (TFT_3.5.5)
LCD_D0: QCopterRC_MCU_Sch (STM32.61), QCopterRC_LCD_Sch (TFT_3.5.7)
LCD_D1: QCopterRC_MCU_Sch (STM32.62), QCopterRC_LCD_Sch (TFT_3.5.8)
LCD_D2: QCopterRC_MCU_Sch (STM32.81), QCopterRC_LCD_Sch (TFT_3.5.9)
LCD_D3: QCopterRC_MCU_Sch (STM32.82), QCopterRC_LCD_Sch (TFT_3.5.10)
LCD_D4: QCopterRC_MCU_Sch (STM32.38), QCopterRC_LCD_Sch (TFT_3.5.11)
LCD_D5: QCopterRC_MCU_Sch (STM32.39), QCopterRC_LCD_Sch (TFT_3.5.12)
LCD_D6: QCopterRC_MCU_Sch (STM32.40), QCopterRC_LCD_Sch (TFT_3.5.13)
LCD_D7: QCopterRC_MCU_Sch (STM32.41), QCopterRC_LCD_Sch (TFT_3.5.14)
LCD_D8: QCopterRC_MCU_Sch (STM32.42), QCopterRC_LCD_Sch (TFT_3.5.15)
LCD_D9: QCopterRC_MCU_Sch (STM32.43), QCopterRC_LCD_Sch (TFT_3.5.16)
LCD_D10: QCopterRC_MCU_Sch (STM32.44), QCopterRC_LCD_Sch (TFT_3.5.17)
LCD_D11: QCopterRC_MCU_Sch (STM32.45), QCopterRC_LCD_Sch (TFT_3.5.18)
LCD_D12: QCopterRC_MCU_Sch (STM32.46), QCopterRC_LCD_Sch (TFT_3.5.19)
LCD_D13: QCopterRC_MCU_Sch (STM32.55), QCopterRC_LCD_Sch (TFT_3.5.20)
LCD_D14: QCopterRC_MCU_Sch (STM32.56), QCopterRC_LCD_Sch (TFT_3.5.21)
LCD_D15: QCopterRC_MCU_Sch (STM32.57), QCopterRC_LCD_Sch (TFT_3.5.22)
LCD_RD: QCopterRC_MCU_Sch (STM32.85), QCopterRC_LCD_Sch (TFT_3.5.3)
LCD_RS: QCopterRC_MCU_Sch (STM32.58), QCopterRC_LCD_Sch (TFT_3.5.6)
LCD_RST: QCopterRC_MCU_Sch (STM32.59), QCopterRC_LCD_Sch (TFT_3.5.24)
LCD_WR: QCopterRC_MCU_Sch (STM32.86), QCopterRC_LCD_Sch (TFT_3.5.4)
LED_B: QCopterRC_LED_Sch (R8.1), QCopterRC_MCU_Sch (STM32.91)
LED_G: QCopterRC_LED_Sch (R7.1), QCopterRC_MCU_Sch (STM32.92)
LED_R: QCopterRC_LED_Sch (R6.1), QCopterRC_MCU_Sch (STM32.93)
LED_Y: QCopterRC_LED_Sch (R9.1), QCopterRC_MCU_Sch (STM32.90)
NRF_CE: QCopterRC_MCU_Sch (STM32.97), QCopterRC_NRF_Sch (NRF.2)
NRF_CSN: QCopterRC_MCU_Sch (STM32.51), QCopterRC_NRF_Sch (NRF.3)
NRF_IRQ: QCopterRC_MCU_Sch (STM32.98), QCopterRC_NRF_Sch (NRF.7)
NRF_MISO: QCopterRC_MCU_Sch (STM32.53), QCopterRC_NRF_Sch (NRF.6)
NRF_MOSI: QCopterRC_MCU_Sch (STM32.54), QCopterRC_NRF_Sch (NRF.5)
NRF_SCK: QCopterRC_MCU_Sch (STM32.52), QCopterRC_NRF_Sch (NRF.4)
SD_CLK: QCopterRC_MCU_Sch (STM32.80), QCopterRC_LCD_Sch (TFT_3.5.35)
SD_CMD: QCopterRC_MCU_Sch (STM32.83), QCopterRC_LCD_Sch (TFT_3.5.34)
SD_D0: QCopterRC_MCU_Sch (STM32.65), QCopterRC_LCD_Sch (TFT_3.5.36)
SD_D1: QCopterRC_MCU_Sch (STM32.66), QCopterRC_LCD_Sch (TFT_3.5.37)
SD_D2: QCopterRC_MCU_Sch (STM32.78), QCopterRC_LCD_Sch (TFT_3.5.38)
SD_D3: QCopterRC_MCU_Sch (STM32.79), QCopterRC_LCD_Sch (TFT_3.5.39)
SW_CLK: QCopterRC_SWD_Sch (SW.3), QCopterRC_MCU_Sch (STM32.76)
SW_DIO: QCopterRC_SWD_Sch (SW.2), QCopterRC_MCU_Sch (STM32.72)
USB_DM: QCopterRC_MCU_Sch (STM32.70), QCopterRC_USB_Sch (R15.2)
USB_DP: QCopterRC_MCU_Sch (STM32.71), QCopterRC_USB_Sch (R16.2)
USB_ID: QCopterRC_MCU_Sch (STM32.69), QCopterRC_USB_Sch (USB.4)